# Altium project 73 VALIANT INDICATOR.PrjPcb
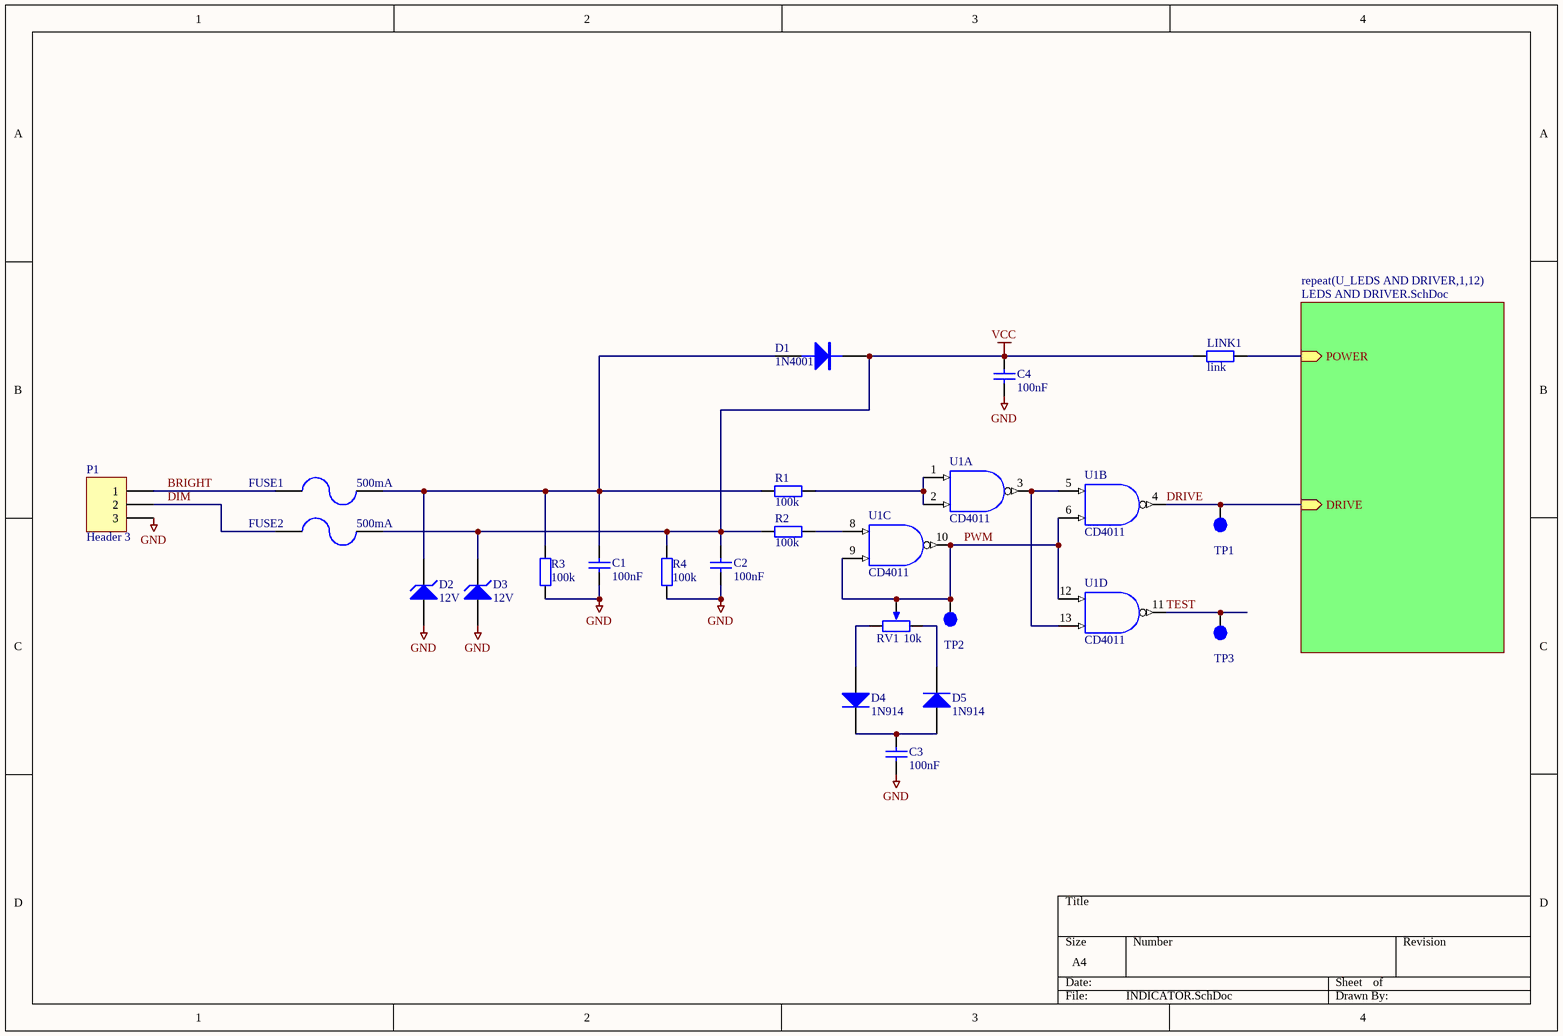
[diagram p0: INDICATOR.SchDoc]
2 sheets, 118 parts. Net scope: hierarchical (ports join the sheet entries above them; power ports are global).
Board file: INDICATOR RIGHT.PcbDoc
Sheets:
  INDICATOR.SchDoc
    U_LEDS AND DRIVER1 = LEDS AND DRIVER.SchDoc
    U_LEDS AND DRIVER2 = LEDS AND DRIVER.SchDoc
    U_LEDS AND DRIVER3 = LEDS AND DRIVER.SchDoc
    U_LEDS AND DRIVER4 = LEDS AND DRIVER.SchDoc
    U_LEDS AND DRIVER5 = LEDS AND DRIVER.SchDoc
    U_LEDS AND DRIVER6 = LEDS AND DRIVER.SchDoc
    U_LEDS AND DRIVER7 = LEDS AND DRIVER.SchDoc
    U_LEDS AND DRIVER8 = LEDS AND DRIVER.SchDoc
    U_LEDS AND DRIVER9 = LEDS AND DRIVER.SchDoc
    U_LEDS AND DRIVER10 = LEDS AND DRIVER.SchDoc
    U_LEDS AND DRIVER11 = LEDS AND DRIVER.SchDoc
    U_LEDS AND DRIVER12 = LEDS AND DRIVER.SchDoc

## Sheet INDICATOR.SchDoc
size A4

### Parts
C1  100nF  [RAD-0.2-0.3]
C2  100nF  [RAD-0.2-0.3]
C3  100nF  [RAD-0.2-0.3]
C4  100nF  [RAD-0.2-0.3]
D1  1N4001  [1N4001]
D2  12V  [1N4001]
D3  12V  [1N4001]
D4  1N914  [DO-35A]
D5  1N914  [DO-35A]
FUSE1  500mA  [miniSMD Polyswitch]
FUSE2  500mA  [miniSMD Polyswitch]
LINK1  value link  [AXIAL-0.4]  (hidden comment: Res2)
P1  Header 3  [TAIL]
R1  value 100k  [AXIAL-0.4]  (hidden comment: Res2)
R2  value 100k  [AXIAL-0.4]  (hidden comment: Res2)
R3  value 100k  [AXIAL-0.4]  (hidden comment: Res2)
R4  value 100k  [AXIAL-0.4]  (hidden comment: Res2)
RV1  10k  [TRIMPOT (10 TURN)]
TP1  TestPoint  [TP_TH]  (value not drawn)
TP2  TestPoint  [TP_TH]  (value not drawn)
TP3  TestPoint  [TP_TH]  (value not drawn)
U1  CD4011  [DIP-14]  (parts A,B,C,D of 4)

### Sub-sheets
repeat(U_LEDS AND DRIVER,1,12) = LEDS AND DRIVER.SchDoc: POWER (in), DRIVE (in)

### Nets
GND: C1.1 C2.1 C3.1 C4.1 D2.2(A) D3.2(A) P1.3 R3.2 R4.2
VCC: C2.2 C4.2 D1.2(K) D3.1(K) FUSE2.2 LINK1.2 R2.2 R4.1 U1.7(VCC) U1.14(GND)
BRIGHT: FUSE1.1 P1.1
DIM: FUSE2.1 P1.2
DRIVE: TP1.1 U1.4(Y) ; sheet repeat(U_LEDS AND DRIVER,1,12)/DRIVE
PWM: RV1.2 TP2.1 U1.6(B) U1.9(B) U1.10(Y) U1.12(A)
TEST: TP3.1 U1.11(Y)
NetC1_2: C1.2 D1.1(A) D2.1(K) FUSE1.2 R1.2 R3.1
NetC3_2: C3.2 D4.2(K) D5.1(A)
NetD4_1: D4.1(A) RV1.1
NetD5_2: D5.2(K) RV1.3
NetD6A_1: LINK1.1 ; sheet repeat(U_LEDS AND DRIVER,1,12)/POWER
NetR1_1: R1.1 U1.1(A) U1.2(B)
NetR2_1: R2.1 U1.8(A)
NetU1_3: U1.3(Y) U1.5(A) U1.13(B)

### Library data of the parts
C1-C4 = Cap: Capacitor; Value: 100nF; Supplier 1: Mouser; Supplier 2: Digi-Key; Supplier Part Number 1: 603-C0603ZRY5V9BB104; Supplier Part Number 2: 311-1343-2-ND
D1 = DIODE: DIODE, POWER; value: 1N4004
D2 D3 = D Zener: ZENER 12V 1W; pin to pad: 1>2 2>1
D4 D5 = Diode 1N914: High Conductance Fast Diode; Published: 8-Jun-2000; LatestRevisionDate: 17-Jul-2002; LatestRevisionNote: Re-released for DXP Platform.; DatasheetVersion: 1997; PackageReference: DO-35; Publisher: Altium Limited; PackageDescription: Diode, Axial; Body 3.8 x 1.9 mm (LxDia. max), Lead Dia. 0.53 mm (max); Code_JEDEC: DO-204-AH; ComponentLink1Description: Manufacturer Link; ComponentLink1URL: http://www.fairchildsemi.com/; ComponentLink2Description: Datasheet; ComponentLink2URL: http://www.fairchildsemi.com/ds/1N%2F1N4448.pdf
FUSE1 FUSE2 = POLYSWITCH 500mA: Manufacturer: Tyco Electronics / Raychem; Manufacturer Part No.: MINISMDC050F-2; Mouser Part no.: 650-MINISMDC050F-2; Farnell Part no.: 1175839; Web link: http://au.mouser.com/ProductDetail/Tyco-Electronics-Raychem/MINISMDC050F-2/?qs=sGAEpiMZZMu7EFbsM1w0neRfX3mrvYIvOpkrchiUGng%3d
LINK1 R1-R4 = Res2: Resistor
P1 = Header 3: Header, 3-Pin; LatestRevisionDate: 17-Jul-2002; LatestRevisionNote: Re-released for DXP Platform.; Publisher: Altium Limited
RV1 = VAR (POT) SMD: Variable Resistor; Manufacturer: Bourns; Manufacturer Part No.: CR0603FX-1002ELF; Value: 10k; Mouser Part no.: 652-CR0603FX-1002ELF; Web link: http://au.mouser.com/Search/Refine.aspx?Keyword=652-CR0603FX-1002ELF
U1 = CD4011: Quadruple 2-Input Positive-NAND Gate

## Sheet LEDS AND DRIVER.SchDoc
size A4
Used 12 times, as channels U_LEDS AND DRIVER1, U_LEDS AND DRIVER2, U_LEDS AND DRIVER3, U_LEDS AND DRIVER4, U_LEDS AND DRIVER5, U_LEDS AND DRIVER6, U_LEDS AND DRIVER7, U_LEDS AND DRIVER8, U_LEDS AND DRIVER9, U_LEDS AND DRIVER10, U_LEDS AND DRIVER11, U_LEDS AND DRIVER12. Parts and nets are listed once, with the designators drawn on the sheet.
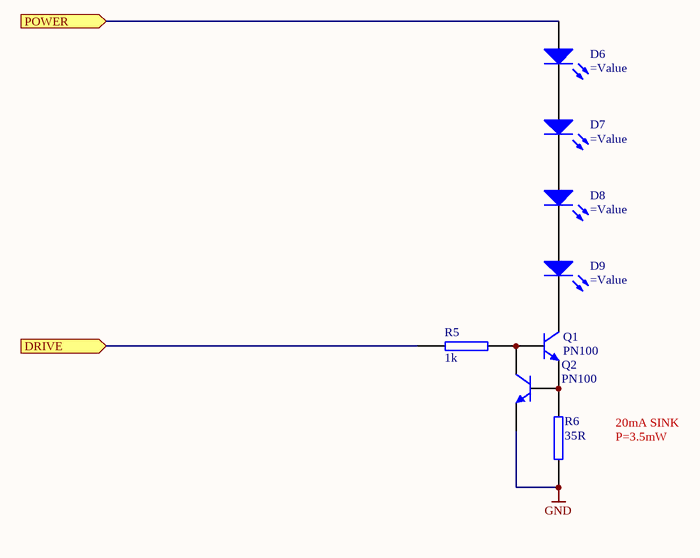
[diagram p1: LEDS AND DRIVER.SchDoc]

### Parts
D6  (no value)  [LED(3D) 5MM VERTICAL (YELLOW)]
D7  (no value)  [LED(3D) 5MM VERTICAL (YELLOW)]
D8  (no value)  [LED(3D) 5MM VERTICAL (YELLOW)]
D9  (no value)  [LED(3D) 5MM VERTICAL (YELLOW)]
Q1  PN100  [TO-92]
Q2  PN100  [TO-92]
R5  1k  [AXIAL-0.4]
R6  35R  [AXIAL-0.4]

### Ports
DRIVE (in), POWER (in)

### Nets
GND: Q2.1(E) R6.1
DRIVE: R5.2 ; port DRIVE
POWER: D6.1(A) ; port POWER
NetD6_2: D6.2(K) D7.1(A)
NetD7_2: D7.2(K) D8.1(A)
NetD8_2: D8.2(K) D9.1(A)
NetD9_2: D9.2(K) Q1.3(C)
NetQ1_1: Q1.1(E) Q2.2(B) R6.2
NetQ1_2: Q1.2(B) Q2.3(C) R5.1

### Channels
U_LEDS AND DRIVER1: designators end in A; ports DRIVE=DRIVE POWER=NetD6A_1
U_LEDS AND DRIVER2: designators end in B; ports DRIVE=DRIVE POWER=NetD6A_1
U_LEDS AND DRIVER3: designators end in C; ports DRIVE=DRIVE POWER=NetD6A_1
U_LEDS AND DRIVER4: designators end in D; ports DRIVE=DRIVE POWER=NetD6A_1
U_LEDS AND DRIVER5: designators end in E; ports DRIVE=DRIVE POWER=NetD6A_1
U_LEDS AND DRIVER6: designators end in F; ports DRIVE=DRIVE POWER=NetD6A_1
U_LEDS AND DRIVER7: designators end in G; ports DRIVE=DRIVE POWER=NetD6A_1
U_LEDS AND DRIVER8: designators end in H; ports DRIVE=DRIVE POWER=NetD6A_1
U_LEDS AND DRIVER9: designators end in I; ports DRIVE=DRIVE POWER=NetD6A_1
U_LEDS AND DRIVER10: designators end in J; ports DRIVE=DRIVE POWER=NetD6A_1
U_LEDS AND DRIVER11: designators end in K; ports DRIVE=DRIVE POWER=NetD6A_1
U_LEDS AND DRIVER12: designators end in L; ports DRIVE=DRIVE POWER=NetD6A_1

### Notes on the sheet
- 20mA SINK
- P=3.5mW

### Library data of the parts
D6-D9 = LED 3mm RED: LED 55
Q1 Q2 = PN100: NPN Bipolar Transistor; Revision: July-2002: Re-released for DXP Platform.; value: PN100
R5 R6 = RES SMD 0603 1k: RESISTOR SMD 0603 1k
  R5: value: 1k
  R6: value: 35R

## Nets that join several sheets
GND: INDICATOR (9 pins), U_LEDS AND DRIVER1 (Q2A.1 R6A.1), U_LEDS AND DRIVER2 (Q2B.1 R6B.1), U_LEDS AND DRIVER3 (Q2C.1 R6C.1), U_LEDS AND DRIVER4 (Q2D.1 R6D.1), U_LEDS AND DRIVER5 (Q2E.1 R6E.1), U_LEDS AND DRIVER6 (Q2F.1 R6F.1), U_LEDS AND DRIVER7 (Q2G.1 R6G.1), U_LEDS AND DRIVER8 (Q2H.1 R6H.1), U_LEDS AND DRIVER9 (Q2I.1 R6I.1), U_LEDS AND DRIVER10 (Q2J.1 R6J.1), U_LEDS AND DRIVER11 (Q2K.1 R6K.1), U_LEDS AND DRIVER12 (Q2L.1 R6L.1)
DRIVE: INDICATOR (TP1.1 U1.4), U_LEDS AND DRIVER1 (R5A.2), U_LEDS AND DRIVER2 (R5B.2), U_LEDS AND DRIVER3 (R5C.2), U_LEDS AND DRIVER4 (R5D.2), U_LEDS AND DRIVER5 (R5E.2), U_LEDS AND DRIVER6 (R5F.2), U_LEDS AND DRIVER7 (R5G.2), U_LEDS AND DRIVER8 (R5H.2), U_LEDS AND DRIVER9 (R5I.2), U_LEDS AND DRIVER10 (R5J.2), U_LEDS AND DRIVER11 (R5K.2), U_LEDS AND DRIVER12 (R5L.2)
NetD6A_1: INDICATOR (LINK1.1), U_LEDS AND DRIVER1 (D6A.1), U_LEDS AND DRIVER2 (D6B.1), U_LEDS AND DRIVER3 (D6C.1), U_LEDS AND DRIVER4 (D6D.1), U_LEDS AND DRIVER5 (D6E.1), U_LEDS AND DRIVER6 (D6F.1), U_LEDS AND DRIVER7 (D6G.1), U_LEDS AND DRIVER8 (D6H.1), U_LEDS AND DRIVER9 (D6I.1), U_LEDS AND DRIVER10 (D6J.1), U_LEDS AND DRIVER11 (D6K.1), U_LEDS AND DRIVER12 (D6L.1)